# Altium schematic sheet Schematic.SchDoc
size 400 x 400 mm; SheetNumber: 1; SheetTotal: 1
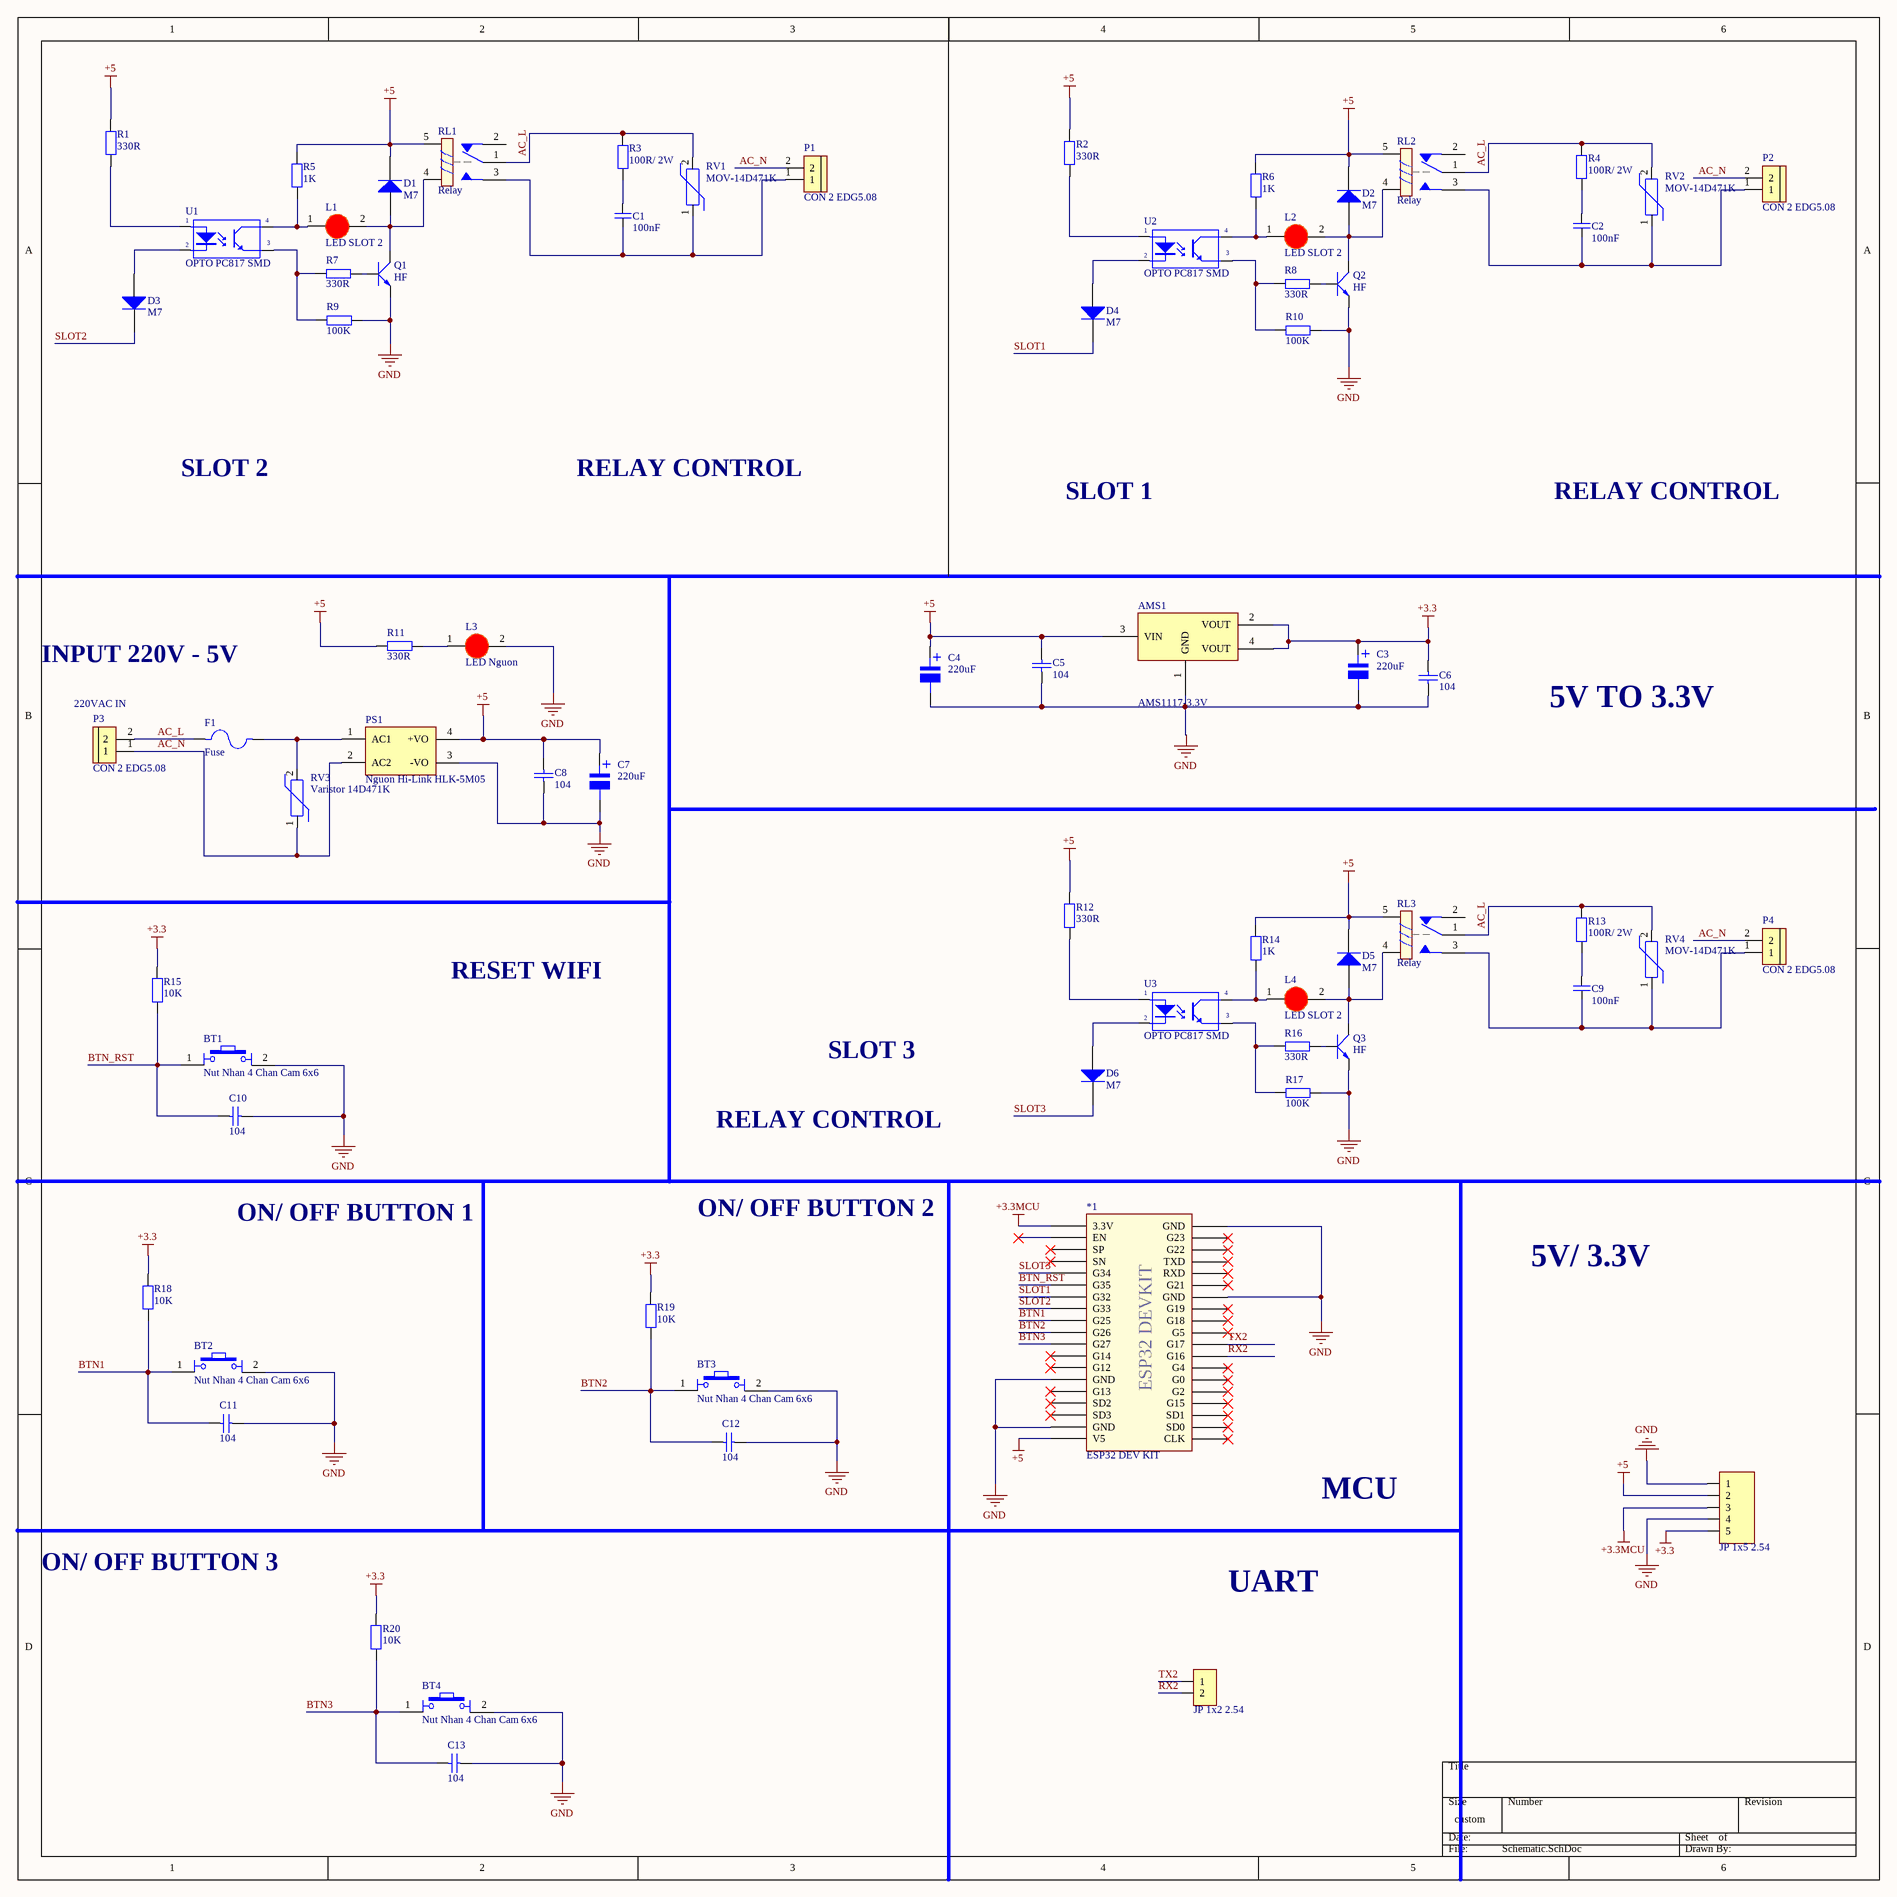
[diagram p0: Schematic.SchDoc]

## Parts
*1  ESP32 DEV KIT  [ESP32 DEVKIT]
AMS1  AMS1117-3.3V  [SOT223]
BT1  Nut Nhan 4 Chan Cam 6x6  [Nut Nhan 4 Chan Cam 6x6]
BT2  Nut Nhan 4 Chan Cam 6x6  [Nut Nhan 4 Chan Cam 6x6]
BT3  Nut Nhan 4 Chan Cam 6x6  [Nut Nhan 4 Chan Cam 6x6]
BT4  Nut Nhan 4 Chan Cam 6x6  [Nut Nhan 4 Chan Cam 6x6]
C1  100nF  [Cap_Poly_684J400V]
C2  100nF  [Cap_Poly_684J400V]
C3  220uF  [tu nhom 6.3 (d)]
C4  220uF  [tu nhom 6.3 (d)]
C5  104  [tu 0805]
C6  104  [tu 0805]
C7  220uF  [tu nhom 6.3 (d)]
C8  104  [tu 0805]
C9  100nF  [Cap_Poly_684J400V]
C10  104  [tu 0805]
C11  104  [tu 0805]
C12  104  [tu 0805]
C13  104  [tu 0805]
D1  M7  [DIODE SMA]
D2  M7  [DIODE SMA]
D3  M7  [DIODE SMA]
D4  M7  [DIODE SMA]
D5  M7  [DIODE SMA]
D6  M7  [DIODE SMA]
F1  Fuse  [FUSE]
JP1  JP 1x5 2.54  [JP 1x5 DT]
JP2  JP 1x2 2.54  [JP 1x2 DT]
L1  LED SLOT 2  [LED-5MM-RED]
L2  LED SLOT 2  [LED-5MM-RED]
L3  LED Nguon  [LED-5MM-RED]
L4  LED SLOT 2  [LED-5MM-RED]
P1  CON 2 EDG5.08  [CON 2 2EDG5.08]
P2  CON 2 EDG5.08  [CON 2 2EDG5.08]
P3  CON 2 EDG5.08  [CON 2 2EDG5.08]
P4  CON 2 EDG5.08  [CON 2 2EDG5.08]
PS1  Nguon Hi-Link HLK-5M05  [Nguon HI-LINK 5M05]
Q1  HF  [SOT-23]
Q2  HF  [SOT-23]
Q3  HF  [SOT-23]
R1  330R  [Tro SMD 0805]
R2  330R  [Tro SMD 0805]
R3  100R/ 2W  [tro vach 2w]
R4  100R/ 2W  [tro vach 2w]
R5  1K  [Tro SMD 0805]
R6  1K  [Tro SMD 0805]
R7  330R  [Tro SMD 0805]
R8  330R  [Tro SMD 0805]
R9  100K  [Tro SMD 0805]
R10  100K  [Tro SMD 0805]
R11  330R  [Tro SMD 0805]
R12  330R  [Tro SMD 0805]
R13  100R/ 2W  [tro vach 2w]
R14  1K  [Tro SMD 0805]
R15  10K  [Tro SMD 0805]
R16  330R  [Tro SMD 0805]
R17  100K  [Tro SMD 0805]
R18  10K  [Tro SMD 0805]
R19  10K  [Tro SMD 0805]
R20  10K  [Tro SMD 0805]
RL1  Relay  [Relay 5 Chan SRD]
RL2  Relay  [Relay 5 Chan SRD]
RL3  Relay  [Relay 5 Chan SRD]
RV1  MOV-14D471K  [MOV14D471K]
RV2  MOV-14D471K  [MOV14D471K]
RV3  Varistor 14D471K  [MOV14D471K]
RV4  MOV-14D471K  [MOV14D471K]
U1  OPTO PC817 SMD  [SOP4]
U2  OPTO PC817 SMD  [SOP4]
U3  OPTO PC817 SMD  [SOP4]

## Nets
+3.3: AMS1.2(VOUT) AMS1.4(VOUT) C3.1 C6.1 JP1.5 R15.1 R18.1 R19.1 R20.1
+3.3MCU: *1.1(3.3V) JP1.3
+5: *1.19(V5) AMS1.3(VIN) C4.1 C5.1 C7.1 C8.1 D1.2(K) D2.2(K) D5.2(K) JP1.2 PS1.4(+VO) R1.2 R2.2 R5.2 R6.2 R11.2 R12.2 R14.2 RL1.5 RL2.5 RL3.5
GND: *1.14(GND) *1.18(GND) *1.32(GND) *1.38(GND) AMS1.1(GND) BT1.2 BT2.2 BT3.2 BT4.2 C3.2 C4.2 C5.2 C6.2 C7.2 C8.2 C10.2 C11.2 C12.2 C13.2 JP1.1 JP1.4 L3.2(K) PS1.3(-VO) Q1.2(E) Q2.2(E) Q3.2(E) R9.1 R10.1 R17.1
AC_L: F1.1 P3.2 R3.2 R4.2 R13.2 RL1.1 RL2.1 RL3.1 RV1.2 RV2.2 RV4.2
AC_N: P1.2 P2.2 P3.1 P4.2 PS1.2(AC2) RV3.1
BTN1: *1.9(G25) BT2.1 C11.1 R18.2
BTN2: *1.10(G26) BT3.1 C12.1 R19.2
BTN3: *1.11(G27) BT4.1 C13.1 R20.2
BTN_RST: *1.6(G35) BT1.1 C10.1 R15.2
RX2: *1.27(G16) JP2.2
SLOT1: *1.7(G32) D4.2(K)
SLOT2: *1.8(G33) D3.2(K)
SLOT3: *1.5(G34) D6.2(K)
TX2: *1.28(G17) JP2.1
NetC1_1: C1.1 P1.1 RL1.3 RV1.1
NetC1_2: C1.2 R3.1
NetC2_1: C2.1 P2.1 RL2.3 RV2.1
NetC2_2: C2.2 R4.1
NetC9_1: C9.1 P4.1 RL3.3 RV4.1
NetC9_2: C9.2 R13.1
NetD1_1: D1.1(A) L1.2(K) Q1.3(C) RL1.4
NetD2_1: D2.1(A) L2.2(K) Q2.3(C) RL2.4
NetD3_1: D3.1(A) U1.2(K)
NetD4_1: D4.1(A) U2.2(K)
NetD5_1: D5.1(A) L4.2(K) Q3.3(C) RL3.4
NetD6_1: D6.1(A) U3.2(K)
NetF1_2: F1.2 PS1.1(AC1) RV3.2
NetL1_1: L1.1(A) R5.1 U1.4(C)
NetL2_1: L2.1(A) R6.1 U2.4(C)
NetL3_1: L3.1(A) R11.1
NetL4_1: L4.1(A) R14.1 U3.4(C)
NetQ1_1: Q1.1(B) R7.1
NetQ2_1: Q2.1(B) R8.1
NetQ3_1: Q3.1(B) R16.1
NetR1_1: R1.1 U1.1(A)
NetR2_1: R2.1 U2.1(A)
NetR7_2: R7.2 R9.2 U1.3(E)
NetR8_2: R8.2 R10.2 U2.3(E)
NetR12_1: R12.1 U3.1(A)
NetR16_2: R16.2 R17.2 U3.3(E)

Not connected (* = marked no-connect by the designer): *1 2(EN)* 3(SP)* 4(SN)* 12(G14)* 13(G12)* 15(G13)* 16(SD2)* 17(SD3)* 20(CLK)* 21(SD0)* 22(SD1)* 23(G15)* 24(G2)* 25(G0)* 26(G4)* 29(G5)* 30(G18)* 31(G19)* 33(G21)* 34(RXD)* 35(TXD)* 36(G22)* 37(G23)*; RL1 2; RL2 2; RL3 2

## Notes on the sheet
- SLOT 2
- RELAY CONTROL
- SLOT 1
- INPUT 220V - 5V
- (near P3) 220VAC IN
- 5V TO 3.3V
- RESET WIFI
- SLOT 3
- ON/ OFF BUTTON 1
- ON/ OFF BUTTON 2
- 5V/ 3.3V
- MCU
- ON/ OFF BUTTON 3
- UART
- (in symbol ESP32 DEV KIT) ESP32 DEVKIT
- (in symbol Tu Nhom 220uF 16V) +

## Library data of the parts
AMS1 = AMS1117 SMD: Dán; Value: AMS1117-3.3V SOT223; Don_Vi: Con; Ma_Hang: MH000596; Ghi_Chu: *; Kieu_Chan: *; Chung_Loai: Dán
BT1-BT4 = Nut Nhan 4 Chan Cam 6x6: Nut Nhan 4 Chan 6x6mm; Ten: Nút Nhấn 4 Chân 6x6x5MM DIP; Ma_Hang: MH004584
C1 C2 C9 = Cap_Non-Polar
C3 C4 C7 = Tu Nhom 220uF 16V: Dán; Don_Vi: Con; So_Chan: 2; Ten_Linh_Kien: Tụ Nhôm 220uF 16V 6.3x7.7MM; Ma_Hang: MH002227; Chung_Loai: Dán; Kieu_Chan: *
C5 C6 C8 C10-C13 = Tu 0805 104 50V 10%: Dán; Don_Vi: Con; So_Chan: 2; Ten_Linh_Kien: Tụ 0805 104-100nF 10% 50V; Ma_Hang: MH004551; Chung_Loai: Dán; Kieu_Chan: *
D1-D6 = Diode M7 ( 4007 ): Dán; Don_Vi: Con; Ten_Linh_Kien: Diode M7 1N4007 SMD 1A 1000V; Ma_Hang: MH000944; Chung_Loai: Dán; Ghi_Chu: *
F1 = Fuse: Fuse, TE5 369 Series, Through Hole, Slow Blow, 300VAC, 1A, Radial | Littelfuse 36911000000; SnapEDA_Link: https://www.snapeda.com/parts/36911000000/Littelfuse/view-part/?ref=snap; Package: Radial Littelfuse Inc.; Value: *; MF: Littelfuse; MP: 36911000000; Check_prices: https://www.snapeda.com/parts/36911000000/Littelfuse/view-part/?ref=eda
JP1 = JP 1x5 2.54 Duc Thang: Cắm; Ten_Linh_Kien: Jump Đơn Đực 2.54MM 1x40P Thẳng 11MM; Don_Vi: Con; Ma_Hang: MH000903; Ghi_Chu: *; Kieu_Chan: *; Chung_Loai: Cắm
JP2 = JP 1x2 2.54 Duc Thang: Cắm; Ten_Linh_Kien: Jump Đơn Đực 2.54MM 1x40P Thẳng 11MM; Don_Vi: Con; Ma_Hang: MH000903; Ghi_Chu: *; Kieu_Chan: *; Chung_Loai: Cắm
L1-L4 = LED 5mm Do: Cắm; Don_Vi: Con; Ma_Hang: MH008967; Ten_Linh_Kien: Led 5MM Phủ Đỏ (1000c); Ghi_Chu: *; Kieu_Chan: *; Chung_Loai: Cắm
P1-P4 = CON 2 EDG5.08: Cắm; Ten_Linh_Kien: CON 2 2EDG5.08-2P 5.08MM ( Xanh Cong); Ma_Hang: MH000759; Ghi_Chu: *; Don_Vi: Con; Kieu_Chan: *; Chung_Loai: Cắm
PS1 = Nguon Hi-Link HLK-5M05: AC DC 220V to 5V 5W 5Watt Isolated Switching Step-Down Power Supply Module Converter; Availability: Unavailable; SnapEDA_Link: https://www.snapeda.com/parts/HLK-5M05/Hi-link/view-part/2758659/?ref=snap; MF: Hi-link; Price: None; Package: Package Analog Devices; MP: HLK-5M05; Value: *
Q1-Q3 = Trans C1815 HF SMD: SOT-23; Value: C9014
R1 R2 R5-R12 R14-R20 = Tro 0805 5% 330R: Dán; Don_Vi: Con; So_Chan: 2; Ten_Linh_Kien: Trở 0805 5% 330R; Ma_Hang: MH005337; Chung_Loai: Dán; Kieu_Chan: *
R3 R4 R13 = Tro Vach 2W 5% 100R: Cắm; Don_Vi: Con; So_Chan: 2; Ten_Linh_Kien: Trở 5% 2w 100R; Ma_Hang: MH006357; Chung_Loai: Cắm; Kieu_Chan: *
RL1-RL3 = Relay 5 Chan SRD: Relay 5 Chan; Ma_Hang: MH009374; Ten: Relay 5V10A SRD-05VDC-SL-C Chính Hãng
RV1-RV4 = MOV-14D471K: 470 V 4.5 kA Varistor 1 Circuit Through Hole Disc 14mm; MF: Bourns; Price: None; MP: MOV-14D471K; SnapEDA_Link: https://www.snapeda.com/parts/MOV-14D471K/Bourns/view-part/?ref=snap; Package: Disc-14 Bourns; Availability: In Stock; Check_prices: https://www.snapeda.com/parts/MOV-14D471K/Bourns/view-part/?ref=eda; Purchase-URL: https://pricing.snapeda.com/search/part/MOV-14D471K/?ref=eda; Value: *
U1-U3 = OPTO PC817 SMD: Single Opto; Value: PC817